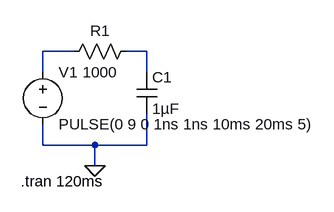
[diagram p0: schematic Draft1.asc]
Draft1.asc, the LTspice schematic file:
Version 4
SHEET 1 2548 680
WIRE 128 112 80 112
WIRE 240 112 208 112
WIRE 80 144 80 112
WIRE 240 144 240 112
WIRE 80 256 80 224
WIRE 160 256 80 256
WIRE 240 256 240 208
WIRE 240 256 160 256
WIRE 160 288 160 256
FLAG 160 288 0
SYMBOL res 224 96 R90
WINDOW 0 0 56 VBottom 2
WINDOW 3 32 56 VTop 2
SYMATTR InstName R1
SYMATTR Value 1000
SYMBOL cap 224 144 R0
SYMATTR InstName C1
SYMATTR Value 1µF
SYMBOL voltage 80 128 R0
WINDOW 123 0 0 Left 2
WINDOW 39 0 0 Left 2
SYMATTR InstName V1
SYMATTR Value PULSE(0 9 0 1ns 1ns 10ms 20ms 5)
TEXT 46 312 Left 2 !.tran 120ms

The netlist it stands for:
* Draft1.asc
R1 N002 N001 1000
C1 N002 0 1µF
V1 N001 0 PULSE(0 9 0 1ns 1ns 10ms 20ms 5)
.tran 120ms
.backanno
.end